# Altium schematic sheet Interlock.SchDoc
size A3
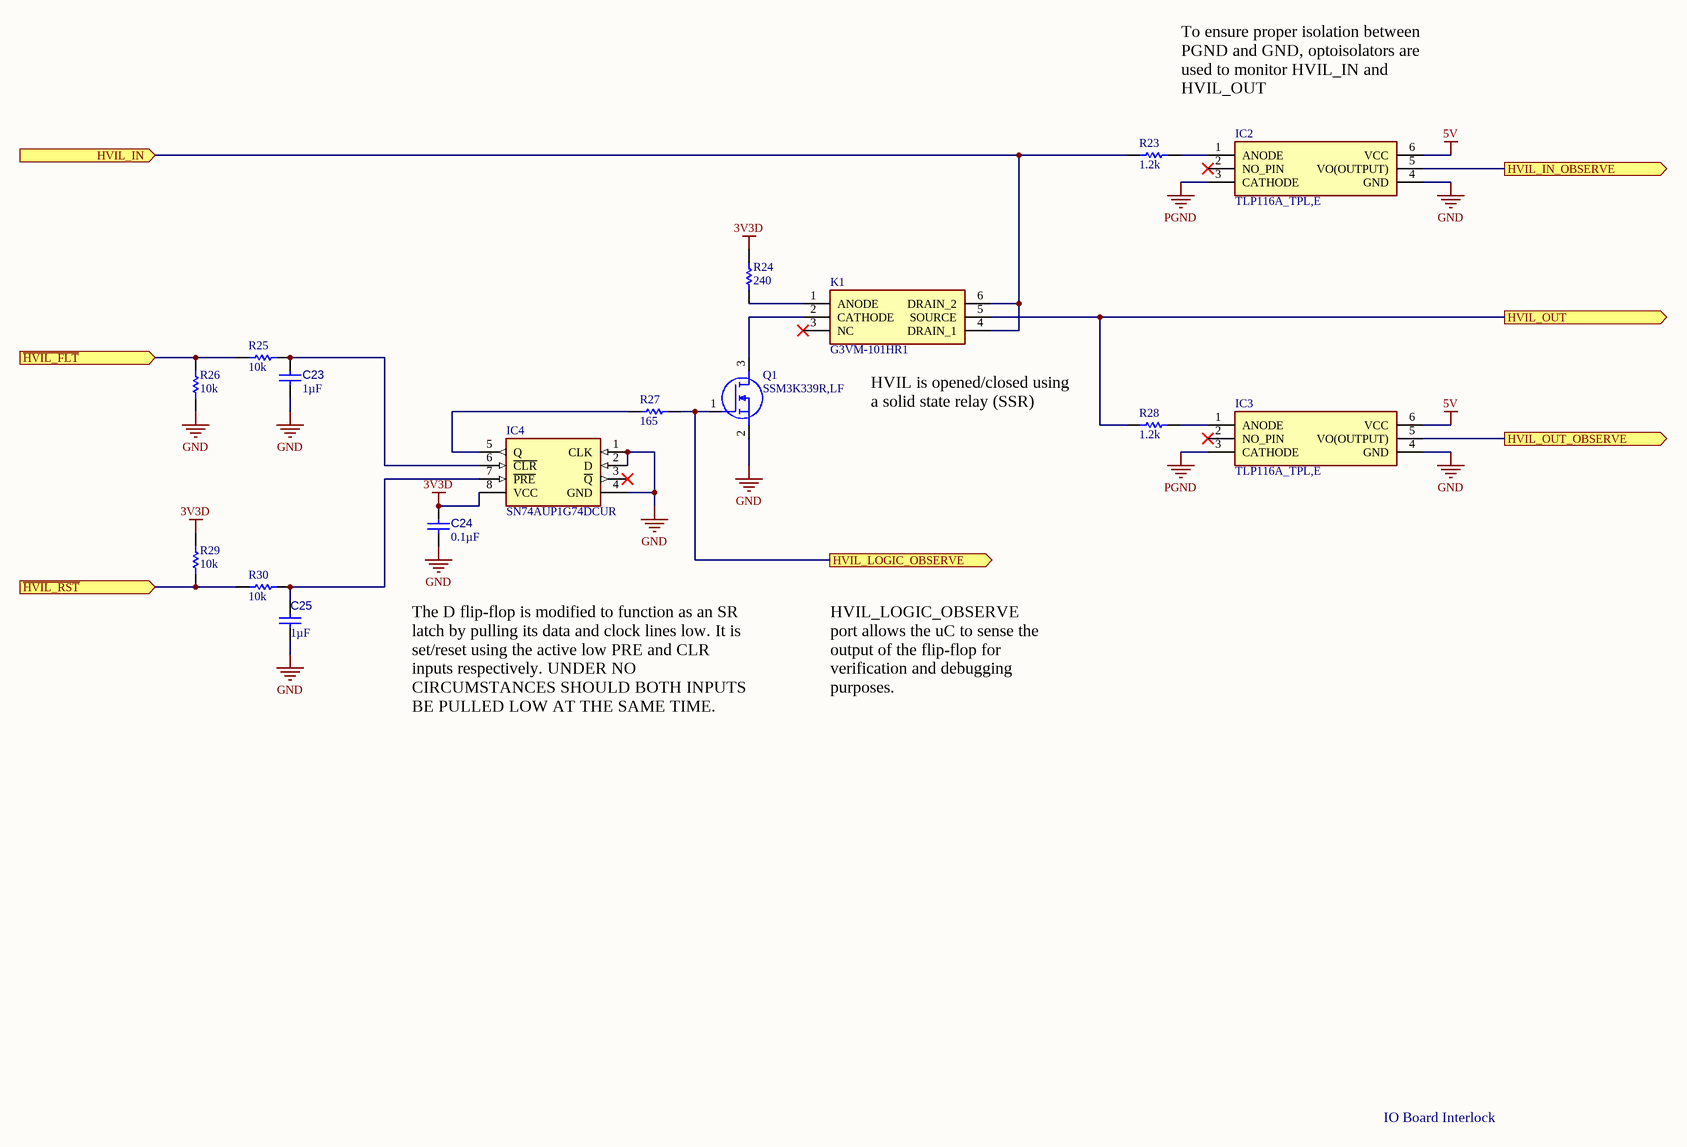
[diagram p0: Interlock.SchDoc]

## Parts
C23  1µF  [CAPC2013X145X50ML20T25]
C24  0.1µF  [CAPC2013X145X50ML20T25]
C25  1µF  [CAPC2013X145X50ML20T25]
IC2  TLP116A_TPL,E  [SOT127P700X230-6N]
IC3  TLP116A_TPL,E  [SOT127P700X230-6N]
IC4  SN74AUP1G74DCUR  [SOT50P310X90-8N]
K1  G3VM-101HR1  [G3VM101HR1]
Q1  SSM3K339R,LF  [SOTFL95P240X88-3N]
R23  1.2k  [RESC2013X50X35ML15T15]
R24  240  [RESC2013X50X35ML15T15]
R25  10k  [RESC2013X50X35ML15T15]
R26  10k  [RESC2013X50X35ML15T15]
R27  165  [RESC2013X50X35ML15T15]
R28  1.2k  [RESC2013X50X35ML15T15]
R29  10k  [RESC2013X50X35ML15T15]
R30  10k  [RESC2013X50X35ML15T15]

## Ports
HVIL_IN (in), HVIL_IN_OBSERVE (out), HVIL_LOGIC_OBSERVE (out), HVIL_OUT (out), HVIL_OUT_OBSERVE (out), ~{HVIL_FLT} (in), ~{HVIL_RST} (in)

## Nets
3V3D: C24.2 IC4.8(VCC) R24.1 R29.2
5V: IC2.6(VCC) IC3.6(VCC)
GND: C23.2 C24.1 C25.1 IC2.4(GND) IC3.4(GND) IC4.1(CLK) IC4.2(D) IC4.4(GND) Q1.2(S) R26.1
PGND: IC2.3(CATHODE) IC3.3(CATHODE)
~{HVIL_FLT}: R25.2 R26.2 ; port ~{HVIL_FLT}
~{HVIL_RST}: R29.1 R30.2 ; port ~{HVIL_RST}
HVIL_IN: K1.4(DRAIN_1) K1.6(DRAIN_2) R23.1 ; port HVIL_IN
HVIL_IN_OBSERVE: IC2.5(VO(OUTPUT)) ; port HVIL_IN_OBSERVE
HVIL_LOGIC_OBSERVE: Q1.1(G) R27.2 ; port HVIL_LOGIC_OBSERVE
HVIL_OUT: K1.5(SOURCE) R28.1 ; port HVIL_OUT
HVIL_OUT_OBSERVE: IC3.5(VO(OUTPUT)) ; port HVIL_OUT_OBSERVE
NetC23_1: C23.1 IC4.6(~{CLR}) R25.1
NetC25_2: C25.2 IC4.7(~{PRE}) R30.1
NetIC2_1: IC2.1(ANODE) R23.2
NetIC3_1: IC3.1(ANODE) R28.2
NetIC4_5: IC4.5(Q) R27.1
NetK1_1: K1.1(ANODE) R24.2
NetK1_2: K1.2(CATHODE) Q1.3(D)

Not connected (* = marked no-connect by the designer): IC2 2(NO_PIN)*; IC3 2(NO_PIN)*; IC4 3(~{Q})*; K1 3(NC)*

## Notes on the sheet
- To ensure proper isolation between PGND and GND, optoisolators are used to monitor HVIL_IN and HVIL_OUT
- (near K1) HVIL is opened/closed using a solid state relay (SSR)
- The D flip-flop is modified to function as an SR latch by pulling its data and clock lines low. It is set/reset using the active low PRE and CLR inputs respectively. UNDER NO CIRCUMSTANCES SHOULD BOTH INPUTS BE PULLED LOW AT THE SAME TIME.
- HVIL_LOGIC_OBSERVE port allows the uC to sense the output of the flip-flop for verification and debugging purposes.
- IO Board Interlock

## Library data of the parts
C23 C25 = CMP-001-00010-4: Chip Capacitor, 1 uF, +/-10%, 25 V, 0805 (2012 Metric); Tolerance: 10%; Capacitor Type: Ceramic; Voltage Rating: 25V; Mounting Technology: SM; Case/Package: 0805; Max Operating Temperature: 125°C; RoHS Compliant: True; Value: 1µF; Min Operating Temperature: -55°C; Pins: 2
C24 = CMP-001-00010-4: Chip Capacitor, 0.1 uF, +/-10%, 25 V, 0805 (2012 Metric); Tolerance: 10%; Capacitor Type: Ceramic; Voltage Rating: 25V; Mounting Technology: SM; Case/Package: 0805; Max Operating Temperature: 125°C; RoHS Compliant: True; Value: 0.1µF; Min Operating Temperature: -55°C; Pins: 2
IC2 IC3 = TLP116A_TPL,E: Integrated Circuit; Manufacturer_Name: Toshiba; Manufacturer_Part_Number: TLP116A(TPL,E; Datasheet Link: https://media.digikey.com/pdf/Data%20Sheets/Toshiba%20PDFs/TLP116A.pdf; Height: 2.3mm; Arrow Part Number: TLP116A(TPL,E; Arrow Price/Stock: https://www.arrow.com/en/products/tlp116a-tple/toshiba; Mouser Part Number: 757-TLP116A(TPLE; Mouser Price/Stock: https://www.mouser.co.uk/ProductDetail/Toshiba/TLP116ATPLE?qs=HVbQlW5zcXWPuFTVF%252BZ0qw%3D%3D
IC4 = SN74AUP1G74DCUR: Integrated Circuit; Manufacturer_Name: Texas Instruments; Datasheet Link: http://www.ti.com/lit/gpn/sn74aup1g74; Height: 0.9mm; Manufacturer_Part_Number: SN74AUP1G74DCUR; Arrow Part Number: SN74AUP1G74DCUR; Arrow Price/Stock: https://www.arrow.com/en/products/sn74aup1g74dcur/texas-instruments; Mouser Part Number: 595-SN74AUP1G74DCUR; Mouser Price/Stock: https://www.mouser.co.uk/ProductDetail/Texas-Instruments/SN74AUP1G74DCUR?qs=7kv20MEVUlht0wF4P3v%252Bhg%3D%3D
K1 = G3VM-101HR1: Relay or Contactor; Manufacturer_Name: Omron Electronics; Datasheet Link: https://componentsearchengine.com/Datasheets/1/G3VM-101HR1.pdf; Height: 2.1mm; Manufacturer_Part_Number: G3VM-101HR1; Arrow Part Number: G3VM-101HR1; Arrow Price/Stock: https://www.arrow.com/en/products/g3vm-101hr1/omron; Mouser Part Number: 653-G3VM-101HR1; Mouser Price/Stock: https://www.mouser.com/Search/Refine.aspx?Keyword=653-G3VM-101HR1
Q1 = SSM3K339R,LF: MOSFET (N-Channel); Manufacturer_Name: Toshiba; Datasheet Link: https://www.arrow.com/en/products/ssm3k339rlf/toshiba; Height: 0.88mm; Manufacturer_Part_Number: SSM3K339R,LF; Arrow Part Number: SSM3K339R,LF; Arrow Price/Stock: https://www.arrow.com/en/products/ssm3k339rlf/toshiba; Mouser Part Number: 757-SSM3K339RLF; Mouser Price/Stock: https://www.mouser.co.uk/ProductDetail/Toshiba/SSM3K339RLF?qs=vPP9GyyTAo2h4IM%252B%252BLvR%252BA%3D%3D
R23 R26 R28 = CMP-009-00001-4: Chip Resistor, 1.2k Ohm, +/- 1%, 125 mW, -55 to 155 degC, 0805 (2012 Metric); Power: 125mW; Voltage Rating: 150V; Tolerance: 1%; Mounting Technology: SM; Min Operating Temperature: -55°C; Case/Package: 0805; Pins: 2; Max Operating Temperature: 155°C; RoHS Compliant: True
  R23 R28: Value: 1.2k
  R26: Value: 10k
R24 = CMP-009-00001-4: Chip Resistor, 240 Ohm, +/- 1%, 125 mW, -55 to 155 degC, 0805 (2012 Metric); Power: 125mW; Voltage Rating: 150V; Tolerance: 1%; Mounting Technology: SM; Value: 240; Min Operating Temperature: -55°C; Case/Package: 0805; Pins: 2; Max Operating Temperature: 155°C; RoHS Compliant: True
R25 R29 R30 = CMP-009-00001-4: Chip Resistor, 10k Ohm, +/- 1%, 125 mW, -55 to 155 degC, 0805 (2012 Metric); Power: 125mW; Voltage Rating: 150V; Tolerance: 1%; Mounting Technology: SM; Value: 10k; Min Operating Temperature: -55°C; Case/Package: 0805; Pins: 2; Max Operating Temperature: 155°C; RoHS Compliant: True
R27 = CMP-009-00001-4: Chip Resistor, 165 Ohm, +/- 1%, 125 mW, -55 to 155 degC, 0805 (2012 Metric); Power: 125mW; Voltage Rating: 150V; Tolerance: 1%; Mounting Technology: SM; Value: 165; Min Operating Temperature: -55°C; Case/Package: 0805; Pins: 2; Max Operating Temperature: 155°C; RoHS Compliant: True